# Altium schematic sheet Voltage Step Up Regulator.SchDoc
size A
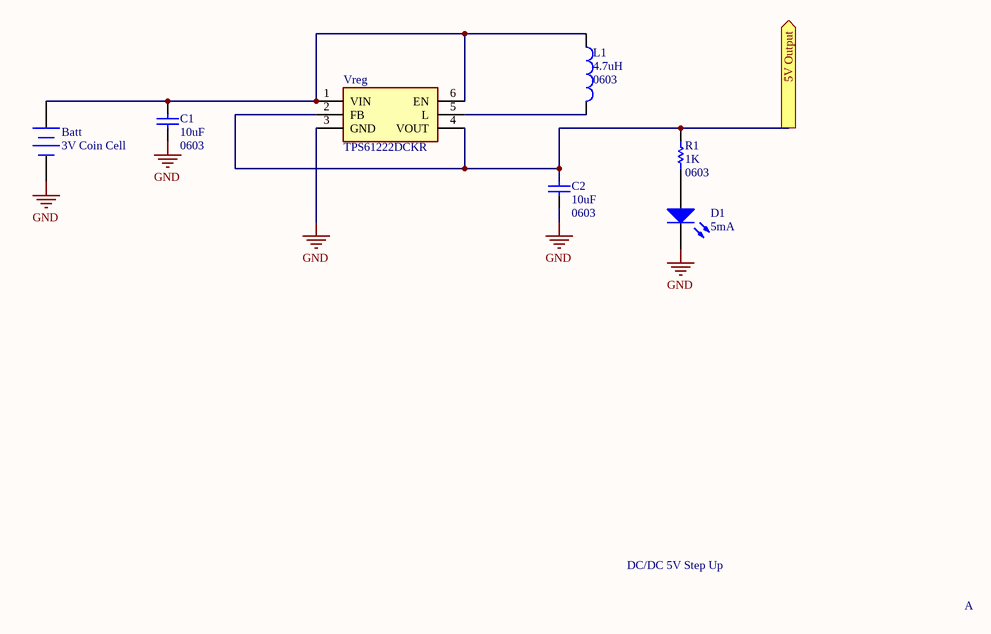
[diagram p0: Voltage Step Up Regulator.SchDoc]

## Parts
Batt  3V Coin Cell  [*BAT_BU2032SM-JJ-GTR_BU2032SM-JJ-GTR(Primary)]
C1  10uF  value 0603  [SMD-0603C]
C2  10uF  value 0603  [SMD-0603C]
D1  5mA  [*0603]
L1  4.7uH  value 0603  [INDC1608L]
R1  1K  value 0603  [SMD-0603-RES]
Vreg  TPS61222DCKR  [*TPS61221_TPS61221(Primary)]

## Ports
5V Output (out)

## Nets
GND: Batt.2(-) C1.2 C2.2 D1.2(K) Vreg.3(GND)
5V Output: C2.1 R1.1 Vreg.2(FB) Vreg.4(VOUT) ; port 5V Output
NetBatt_1: Batt.1(+) C1.1 L1.1 Vreg.1(VIN) Vreg.6(EN)
NetD1_1: D1.1(A) R1.2
NetL1_2: L1.2 Vreg.5(L)

## Notes on the sheet
- DC/DC 5V Step Up
- A

## Library data of the parts
Batt = Battery: Multicell Battery; Published: 24-Mar-1999; LatestRevisionDate: 17-Jul-2002; LatestRevisionNote: Re-released for DXP Platform.; PackageReference: BAT-2; Publisher: Altium Limited; PackageDescription: Battery; 2 Leads
C1 C2 = Cap: Capacitor; Published: 8-Jun-2000; LatestRevisionDate: 17-Jul-2002; LatestRevisionNote: Re-released for DXP Platform.; PackageReference: RAD-0.3; Publisher: Altium Limited; PackageDescription: Radial Cap, Thru-Hole; 2 Leads; 0.3 in Pin Spacing
D1 = LED0: Typical INFRARED GaAs LED; Published: 8-Jun-2000; LatestRevisionDate: 08-Jul-2005; LatestRevisionNote: Mech Layer 1 removed.; PackageReference: LED-0; Publisher: Altium Limited; PackageDescription: LED; 2 Leads
L1 = Inductor: Code_IEC: 1005; Published: 8-Jun-2000; LatestRevisionDate: 29-May-2009; LatestRevisionNote: IPC-7351 Footprint Added.; PackageReference: 0402-A; Publisher: Altium Limited; PackageDescription: Chip Inductor; Code_JEITA: 0402
R1 = Res1: Resistor; Published: 8-Jun-2000; LatestRevisionDate: 17-Jul-2002; LatestRevisionNote: Re-released for DXP Platform.; PackageReference: AXIAL-0.3; Publisher: Altium Limited; PackageDescription: Axial Device, Thru-Hole; 2 Leads; 0.3 in Pin Spacing
Vreg = TPS61222DCKR: Integrated Circuit; Manufacturer_Name: Texas Instruments; Datasheet Link: https://www.ti.com/lit/gpn/TPS61222; Height: 1.1mm; Manufacturer_Part_Number: TPS61222DCKR; Mouser Part Number: 595-TPS61222DCKR; Mouser Price/Stock: https://www.mouser.com/Search/Refine.aspx?Keyword=595-TPS61222DCKR